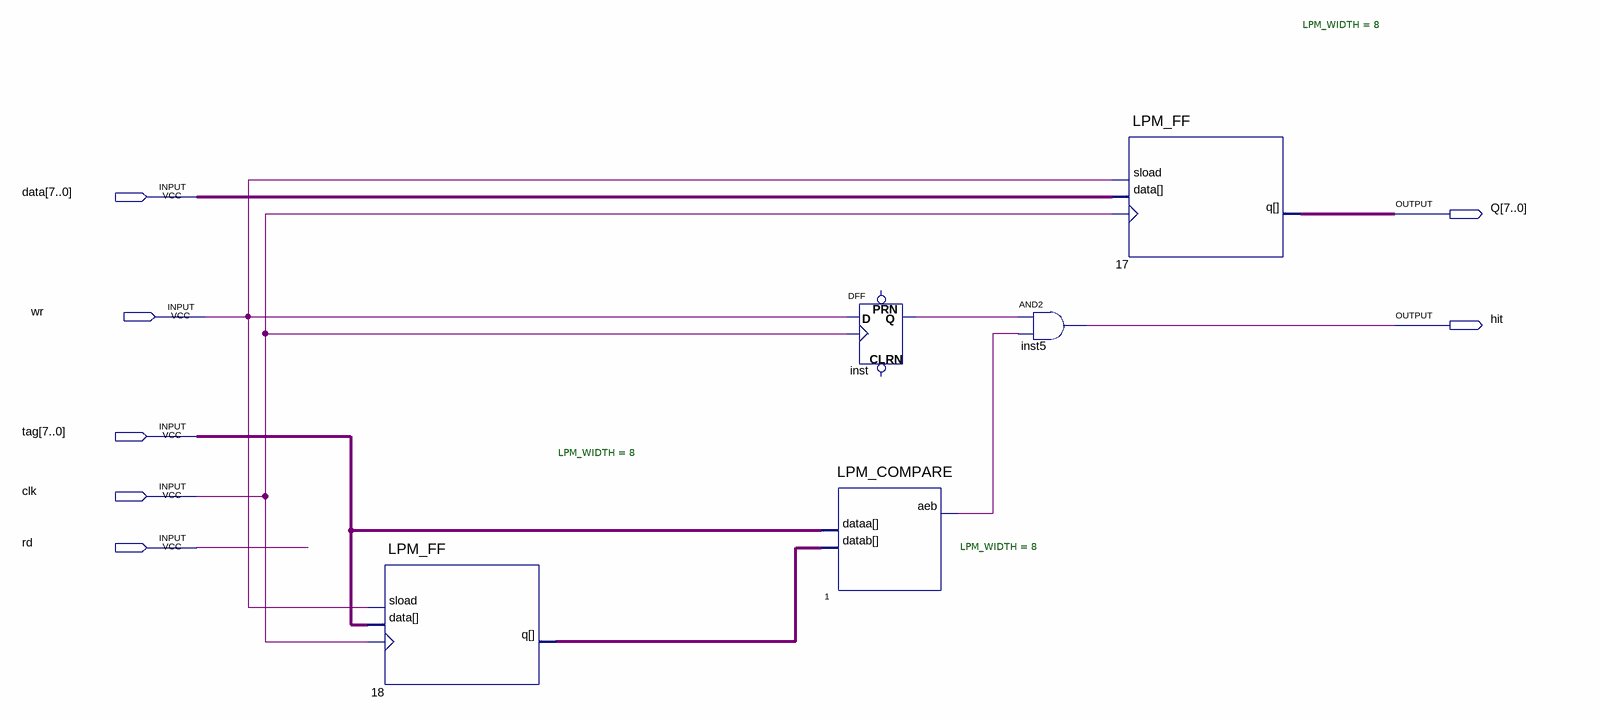
[diagram p0: schematic sheet]
// Quartus schematic cache_element.bdf as structural Verilog: 5 symbols, 7 pins
module cache_element (
  input  [7:0] data,
  input  wr,
  input  [7:0] tag,
  input  clk,
  input  rd,
  output [7:0] Q,
  output hit
);

  wire inst_q, n1_aeb;
  wire [7:0] n18_q;

  LPM_FF #(.LPM_WIDTH(8)) u_18 (.clock(clk), .sload(wr), .data(tag), .q(n18_q));
  LPM_COMPARE #(.LPM_WIDTH(8)) u_1 (.dataa(tag), .datab(n18_q), .aeb(n1_aeb));
  DFF inst (.CLK(clk), .D(wr), .Q(inst_q));  // open: CLRN, PRN
  and inst5 (hit, inst_q, n1_aeb);
  LPM_FF #(.LPM_WIDTH(8)) u_17 (.clock(clk), .sload(wr), .data(data), .q(Q));
endmodule
